# Altium schematic sheet Schematic_EndEffector_DCMotorControl.SchDoc
size A4; SheetNumber: 1; SheetTotal: 1
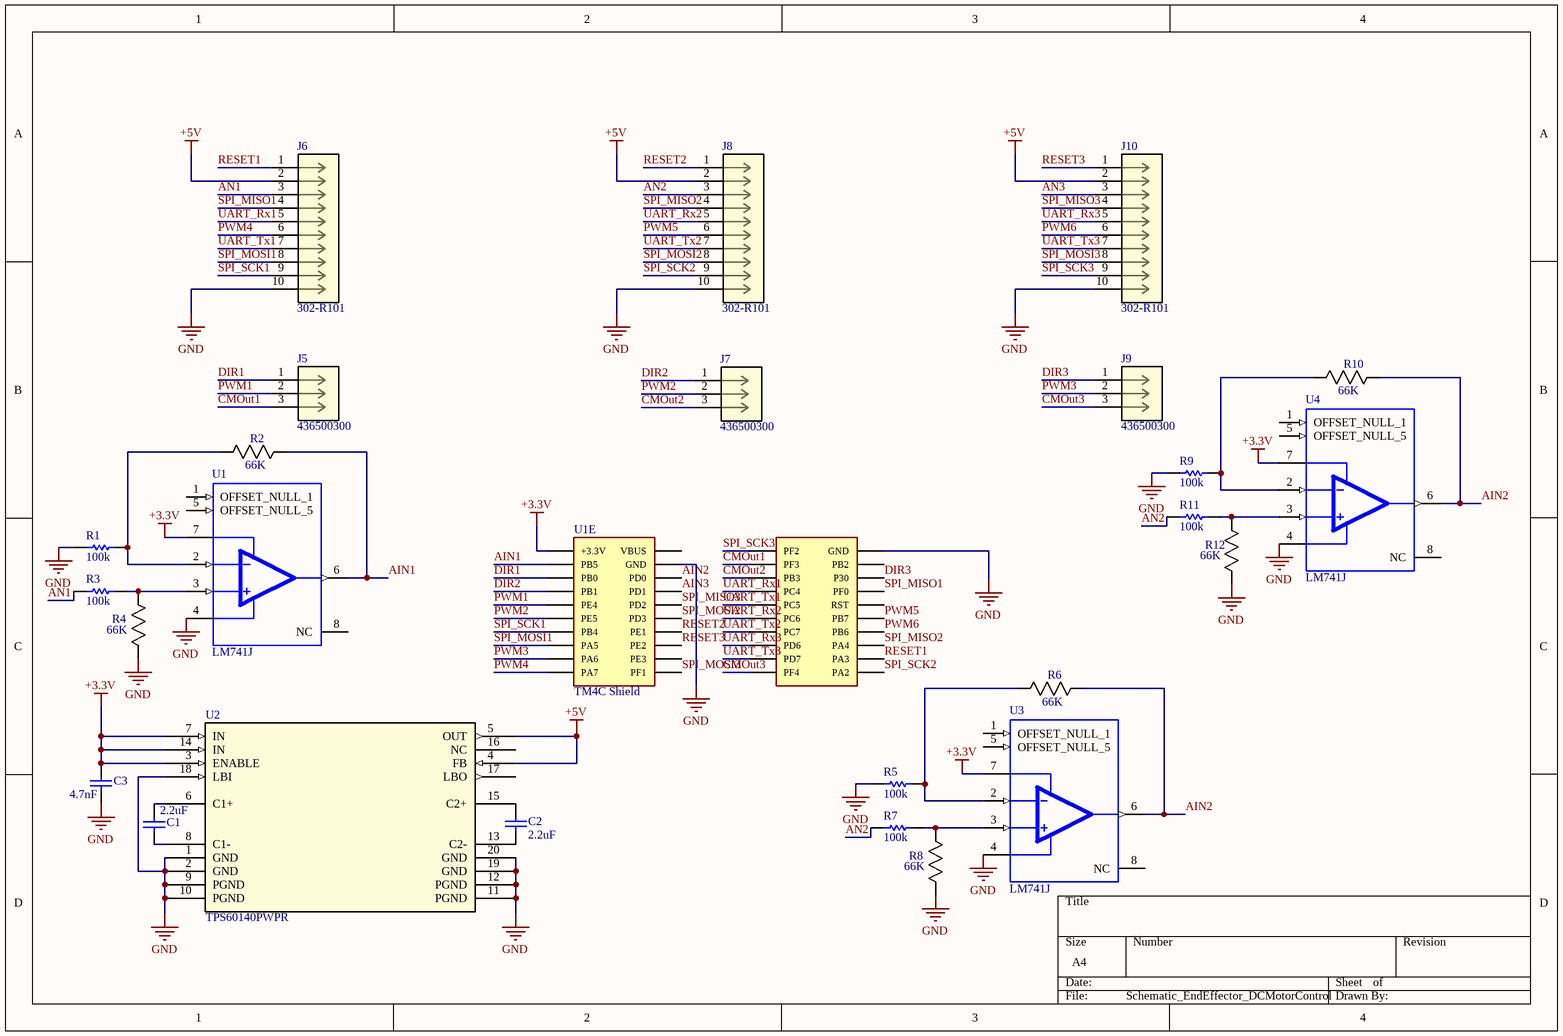
[diagram p0: Schematic_EndEffector_DCMotorControl.SchDoc]

## Parts
(Parts that share a designator on the sheet are numbered #1, #2 ... from top to bottom, then left to right.)
C1  2.2uF  [CAP_0603]
C2  2.2uF  [CAP_0603]
C3  4.7nF  [CAP_0603]
J5  436500300  [CON_436500300_MOL]
J6  302-R101  [CONN_302-R101_OST]
J7  436500300  [CON_436500300_MOL]
J8  302-R101  [CONN_302-R101_OST]
J9  436500300  [CON_436500300_MOL]
J10  302-R101  [CONN_302-R101_OST]
R1  100k  [RES_0603]
R2  66K  [STA_RMCF0603_STP]
R3  100k  [RES_0603]
R4  66K  [STA_RMCF0603_STP]
R5  100k  [RES_0603]
R6  66K  [STA_RMCF0603_STP]
R7  100k  [RES_0603]
R8  66K  [STA_RMCF0603_STP]
R9  100k  [RES_0603]
R10  66K  [STA_RMCF0603_STP]
R11  100k  [RES_0603]
R12  66K  [STA_RMCF0603_STP]
U1#1  LM741J  [DIP775W46P254L1016H508Q8]
U1#2  TM4C Shield  [SAMTEC_TSW-110-23-S-D]  (part E of 5)
U2  TPS60140PWPR  [PWP20_3P38X2P4]
U3  LM741J  [DIP775W46P254L1016H508Q8]
U4  LM741J  [DIP775W46P254L1016H508Q8]

## Nets
+3.3V: C3.1 U1#1.7(V+) U1#2.+3.3V U2.3(ENABLE) U2.7(IN) U2.14(IN) U3.7(V+) U4.7(V+)
+5V: J6.2 J8.2 J10.2 U2.4(FB) U2.5(OUT)
GND: C3.2 J6.10 J8.10 J10.10 R1.1 R4.1 R5.1 R8.1 R9.1 R12.1 U1#1.4(V-) U1#2.GND U2.1(GND) U2.2(GND) U2.9(PGND) U2.10(PGND) U2.11(PGND) U2.12(PGND) U2.18(LBI) U2.19(GND) U2.20(GND) U3.4(V-) U4.4(V-)
AIN1: R2.2 U1#1.6(OUTPUT) U1#2.PB5
AIN2: R6.2 R10.2 U1#2.PD0 U3.6(OUTPUT) U4.6(OUTPUT)
AIN3: U1#2.PD1
AN1: J6.3 R3.1
AN2: J8.3 R7.1 R11.1
AN3: J10.3
CMOut1: J5.3 U1#2.PF3
CMOut2: J7.3 U1#2.PB3
CMOut3: J9.3 U1#2.PF4
DIR1: J5.1 U1#2.PB0
DIR2: J7.1 U1#2.PB1
DIR3: J9.1 U1#2.P30
PWM1: J5.2 U1#2.PE4
PWM2: J7.2 U1#2.PE5
PWM3: J9.2 U1#2.PA6
PWM4: J6.6 U1#2.PA7
PWM5: J8.6 U1#2.PB7
PWM6: J10.6 U1#2.PB6
RESET1: J6.1 U1#2.PA3
RESET2: J8.1 U1#2.PE1
RESET3: J10.1 U1#2.PE2
SPI_MISO1: J6.4 U1#2.PF0
SPI_MISO2: J8.4 U1#2.PA4
SPI_MISO3: J10.4 U1#2.PD2
SPI_MOSI1: J6.8 U1#2.PA5
SPI_MOSI2: J8.8 U1#2.PD3
SPI_MOSI3: J10.8 U1#2.PF1
SPI_SCK1: J6.9 U1#2.PB4
SPI_SCK2: J8.9 U1#2.PA2
SPI_SCK3: J10.9 U1#2.PF2
UART_Rx1: J6.5 U1#2.PC4
UART_Rx2: J8.5 U1#2.PC6
UART_Rx3: J10.5 U1#2.PD6
UART_Tx1: J6.7 U1#2.PC5
UART_Tx2: J8.7 U1#2.PC7
UART_Tx3: J10.7 U1#2.PD7
NetC1_1: C1.1 U2.8(C1-)
NetC1_2: C1.2 U2.6(C1+)
NetC2_1: C2.1 U2.13(C2-)
NetC2_2: C2.2 U2.15(C2+)
NetR1_2: R1.2 R2.1 U1#1.2(INVERTING_INPUT)
NetR3_2: R3.2 R4.2 U1#1.3(NONINVERTING_INPUT)
NetR5_2: R5.2 R6.1 U3.2(INVERTING_INPUT)
NetR7_2: R7.2 R8.2 U3.3(NONINVERTING_INPUT)
NetR9_2: R9.2 R10.1 U4.2(INVERTING_INPUT)
NetR11_2: R11.2 R12.2 U4.3(NONINVERTING_INPUT)

Not connected (* = marked no-connect by the designer): U1#1 1(OFFSET_NULL_1) 5(OFFSET_NULL_5) 8(NC); U1#2 PB2 PE3 RST VBUS; U2 16(NC) 17(LBO); U3 1(OFFSET_NULL_1) 5(OFFSET_NULL_5) 8(NC); U4 1(OFFSET_NULL_1) 5(OFFSET_NULL_5) 8(NC)

## Library data of the parts
C1 C2 = 2.2uF_35V_0603: CAP CER 2.2UF 35V 10% X5R 0603; Manufacturer: Murata Electronics North America; Manufacturer Part Number: GRM188R6YA225KA12D; Capacitance: 2.2µF; Supplier 1: Digi-Key; Supplier Part Number 1: 490-7204-1-ND; RoHS: RoHS Compliant; Category: Capacitors; Stock 1: 55248; Pricing 1: 1=0.31, 10=0.214, 50=0.1298, 100=0.109, 250=0.08832, 500=0.07792, 1000=0.06624 (CAD); Packaging: Cut Tape (CT); Tolerance: ±10%; Voltage - Rated: 35V; Temperature Coefficient: X5R; Mounting Type: Surface Mount, MLCC; Operating Temperature: -55°C ~ 85°C; Applications: General Purpose; Ratings: -; Package / Case: 0603 (1608 Metric); Size / Dimension: 0.063" L x 0.031" W (1.60mm x 0.80mm); Height - Seated (Max): -; Thickness (Max): 0.031" (0.80mm); Lead Spacing: -; Features: -; Lead Style: -; ComponentLink1URL: http://www.murata.com/~/media/webrenewal/support/library/catalog/products/capacitor/mlcc/c02e.ashx; ComponentLink1Description: http://www.murata.com/~/media/webrenewal/support/library/catalog/products/capacitor/mlcc/c02e.ashx
C3 = 4.7nF_50V_0603: CAP CER 4700PF 50V 10% X7R 0603; Manufacturer: Kemet; Manufacturer Part Number: C0603C102K5RACTU; Capacitance: 1000pF; RoHS: RoHS Compliant; Category: Capacitors; Packaging: Cut Tape (CT); Tolerance: ±10%; Voltage - Rated: 50V; Temperature Coefficient: X7R; Mounting Type: Surface Mount, MLCC; Operating Temperature: -55°C ~ 125°C; Applications: General Purpose; Ratings: -; Package / Case: 0603 (1608 Metric); Size / Dimension: 0.063" L x 0.031" W (1.60mm x 0.80mm); Height - Seated (Max): -; Thickness (Max): 0.034" (0.87mm); Lead Spacing: -; Features: -; Lead Style: -; ComponentLink1URL: http://www.kemet.com/docfinder?Partnumber=C0603C102K5RACTU; ComponentLink1Description: http://www.kemet.com/docfinder?Partnumber=C0603C102K5RACTU; Supplier 1: Digi-Key; Stock 1: 163221; Pricing 1: 1=0.13, 10=0.034, 25=0.024, 100=0.0153, 500=0.01072, 1000=0.00835 (CAD); ComponentLink2URL: http://www.samsungsem.com/kr/front/downloadcms.do?path=/kr/support/product-search/mlcc/__icsFiles/afieldfile/2014/11/05&fileName=S_CL10B472KB8SFNC.pdf; ComponentLink2Description: http://www.samsungsem.com/kr/front/downloadcms.do?path=/kr/support/product-search/mlcc/__icsFiles/afieldfile/2014/11/05&fileName=S_CL10B472KB8SFNC.pdf; Supplier Part Number 1: 1276-2066-1-ND
J5 J7 J9 = 436500300: No Description Available; Mfr_Name: Molex Connector Corporation; Copyright: Copyright (C) 2022 Ultra Librarian. All rights reserved.; Manufacturer_Part_Number: 436500300; Digi-Key_Part_Number_1: WM1861-ND; RefDes: RefDes; Type: DEV
J6 J8 J10 = 302-R101: No Description Available; Mfr_Name: On Shore Technology Inc; Copyright: Copyright (C) 2022 Ultra Librarian. All rights reserved.; Manufacturer_Part_Number: 302-R101; Digi-Key_Part_Number_1: ED10533-ND; RefDes: RefDes; Type: DEV
R1 R3 R5 R7 R9 R11 = 100k_1%_0603: RES SMD 100K OHM 1% 1/4W 0603; Manufacturer: Rohm; Manufacturer Part Number: ESR03EZPF1003; Resistance: 100kR; Temperature Coefficient: 100ppm/°C; Max Power Dissipation: 250mW; Supplier 1: Digi-Key; Supplier Part Number 1: RHM100KADTR-ND; Stock 1: 0; Pricing 1: 5000=0.01496 (USD); Case/Package: 0603; Case Code (Metric): 1608; Case Code (Imperial): 0603; Min Operating Temperature: -55°C; Max Operating Temperature: 155°C; Tolerance: 1%; Package Quantity: 1; Packaging: Tape and Reel; Composition: Thick Film; Number of Terminations: 2; Features: Automotive AEC-Q200; Length: 0.063inch; Height: 0.022inch; Width: 0.031inch; ComponentLink1URL: https://datasheet.ciiva.com/2516/esr-2516109.pdf; ComponentLink1Description: https://datasheet.ciiva.com/2516/esr-2516109.pdf; ComponentLink2URL: https://datasheet.ciiva.com/2516/esr-2516110.pdf; ComponentLink2Description: https://datasheet.ciiva.com/2516/esr-2516110.pdf; ComponentLink3URL: https://datasheet.ciiva.com/2516/esr-2516111.pdf; ComponentLink3Description: https://datasheet.ciiva.com/2516/esr-2516111.pdf
R2 R4 R6 R8 R10 R12 = RMCF0603FT66K5: No Description Available; Mfr_Name: Stackpole International; Copyright: Copyright (C) 2022 Ultra Librarian. All rights reserved.; Manufacturer_Part_Number: RMCF0603FT66K5; Digi-Key_Part_Number_1: RMCF0603FT66K5CT-ND; Digi-Key_Part_Number_2: RMCF0603FT66K5DKR-ND; Digi-Key_Part_Number_3: RMCF0603FT66K5TR-ND; RefDes: RefDes; Type: DEV
U1#1 U3 U4 = LM741J: Operational Amplifier 8-CDIP -55 to 125; MF: Texas Instruments; MP: LM741J; Price: None; SnapEDA_Link: https://www.snapeda.com/parts/LM741J/Texas%20Instruments/view-part/54188/?ref=snap; Arrow_Asia-Purchase-URL: https://snapeda.com/shop?store=Arrow+Asia&id=54188; Arrow_Electronics-Purchase-URL: https://snapeda.com/shop?store=Arrow+Electronics&id=54188; Texas_Instruments-Purchase-URL: https://snapeda.com/shop?store=Texas+Instruments&id=54188; Package: CDIP-8 Texas Instruments; DigiKey-Purchase-URL: https://snapeda.com/shop?store=DigiKey&id=54188; Availability: Warning; Value: *; Mouser-Purchase-URL: https://snapeda.com/shop?store=Mouser&id=54188
U1#2 = Component_1
U2 = TPS60140PWPR: No Description Available; Mfr_Name: Texas Instruments; Copyright: Copyright (C) 2022 Ultra Librarian. All rights reserved.; Manufacturer_Part_Number: TPS60140PWPR; Digi-Key_Part_Number_1: 296-2275-1-ND; Digi-Key_Part_Number_2: 296-2275-2-ND; Digi-Key_Part_Number_3: 296-2275-6-ND; Digi-Key_Part_Number_4: 2156-TPS60140PWPR-ND; RefDes: RefDes; Type: DEV